# EAGLE design tritiled_v30 (EAGLE 8.2.2)
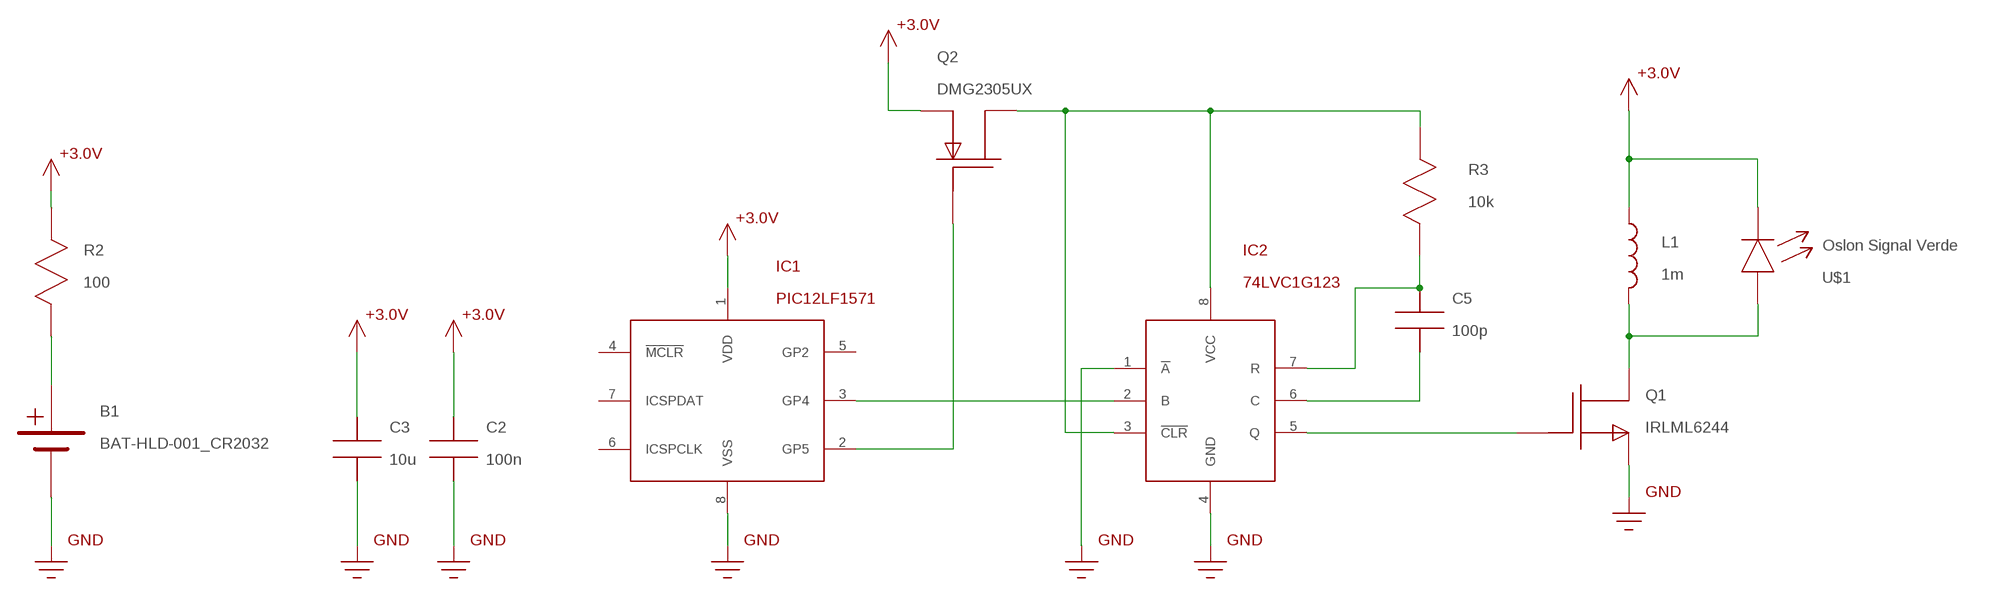
[diagram p0: schematic, sheet 1]

## Parts
B1  BAT-HLD-001_CR2032  [CR2032_BAT-HLD_001]
C2  100n  C0805  [0805]
C3  10u  C1206  [1206]
C5  100p  C0603  [C0603]
IC1  PIC12LF1571  [SOIC8]
IC2  74LVC1G123  [SM8]
L1  1m  SRR6028_INDUCTOR  [SRR6028_INDUCTOR]
Q1  IRLML6244  ZXMN3B01FSOT23  [SOT-23]
Q2  DMG2305UX  DMG2305UXSOT23  [SOT-23]
R2  100  R1206  [R1206]
R3  10k  R0603  [R0603]
U$1  Oslon Signal Verde  OSLON_SIGNAL  [OSLON_3030_LED]

## Nets
+3.6V: C2.P$1 C3.P$1 IC1.1(VDD) L1.P$1 Q2.2(S) R2.P$1 U$1.C ; supply symbol labelled +3.0V
GND: B1.GND(0V) C2.P$2 C3.P$2 IC1.8(VSS) IC2.1(!A!) IC2.4(GND) Q1.2(S)
N$1: C5.P$1 IC2.7(R) R3.P$1
N$2: IC2.5(Q) Q1.1(G)
N$3: IC1.2(GP5) Q2.1(G)
N$4: IC1.3(GP4) IC2.2(B)
N$5: C5.P$2 IC2.6(C)
N$7: IC2.3(!CLR!) IC2.8(VCC) Q2.3(D) R3.P$2
N$9: B1.+V1(+V) B1.+V2(+V) R2.P$2
N$10: L1.P$2 Q1.3(D) U$1.A
Unconnected: IC1.4(!MCLR!) IC1.5(GP2) IC1.6(ICSPCLK) IC1.7(ICSPDAT)

## Library data of the parts
B1 = tritiled:BAT-HLD-001_CR2032
C2 C3 C5 = tritiled:C
IC1 = tritiled:PIC12LF1571
IC2 = tritiled:74LVC1G123
L1 = tritiled:SRR6028_INDUCTOR
Q1 = tritiled:ZXMN3B01F
Q2 = tritiled:DMG2305UX
R2 R3 = tritiled:R
U$1 = tritiled:OSLON_SIGNAL

## Board
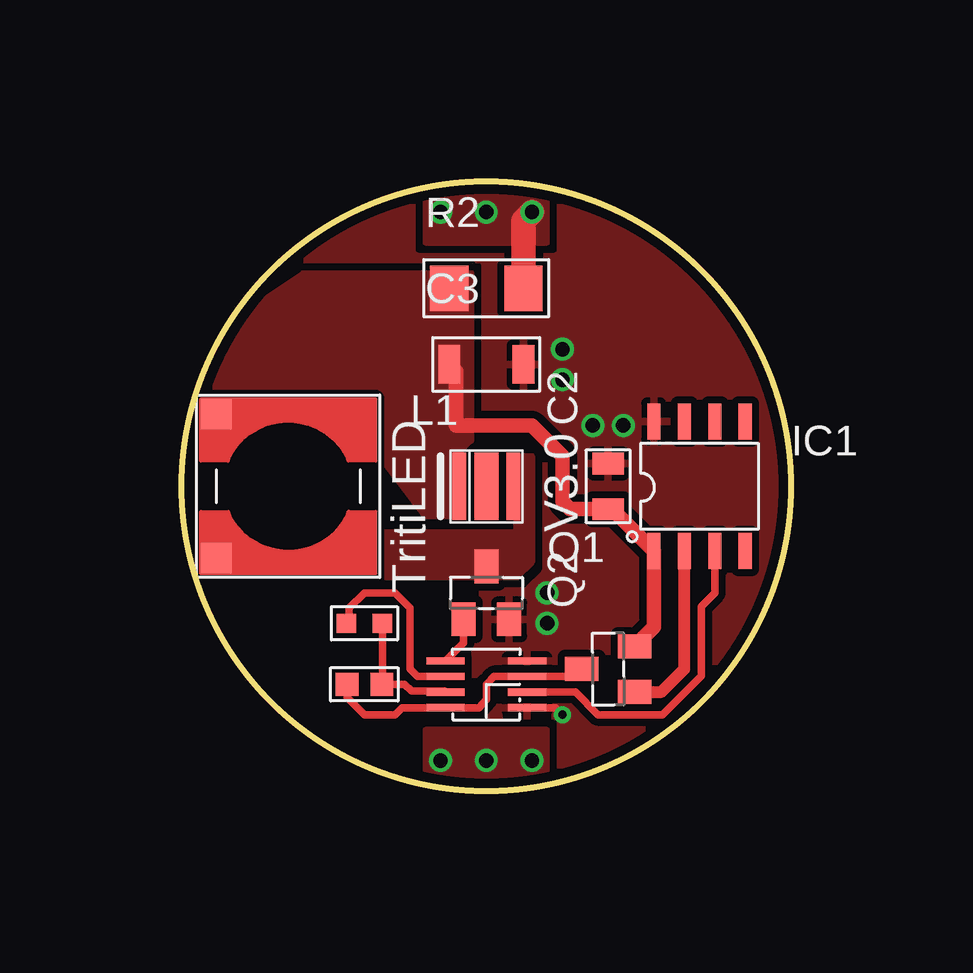
[diagram p1: board, top side]
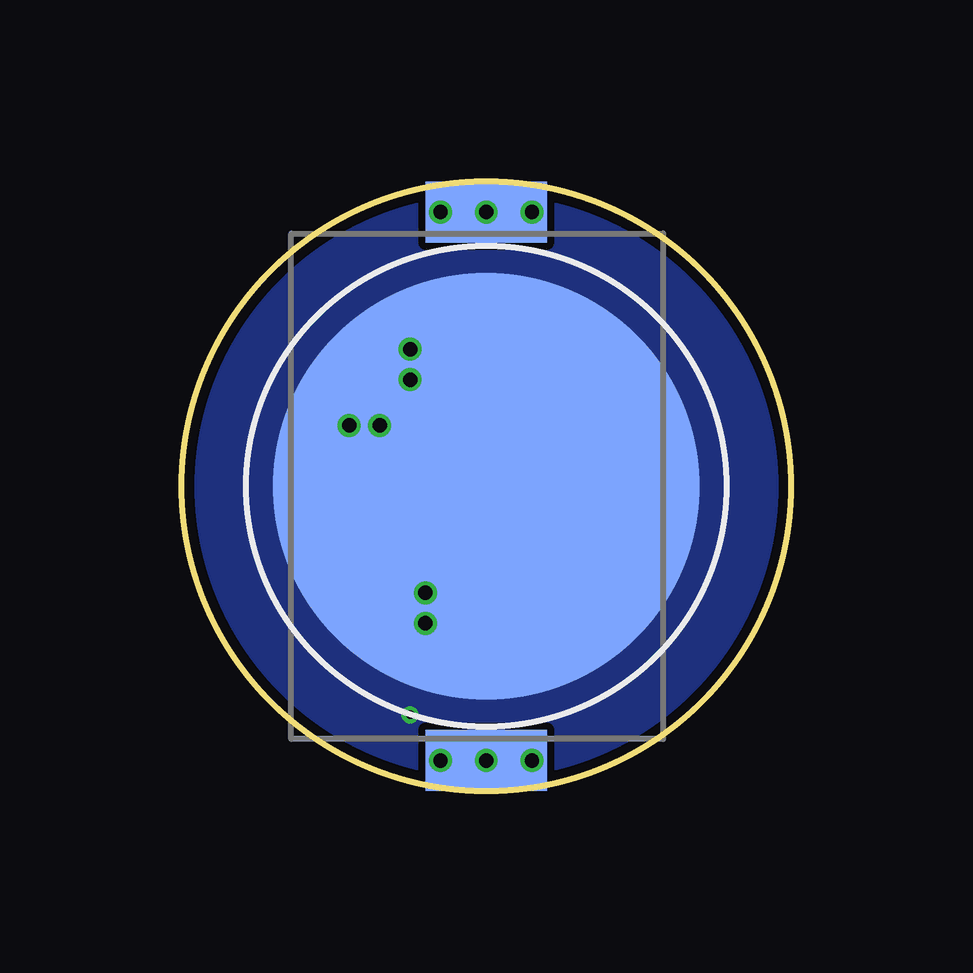
[diagram p2: board, bottom side, seen from below]

Size 25.4 x 25.4 mm. Coordinates in mm from the lower left corner, seen from the top.
Outline: circle at 12.7,12.7 radius 12.7
Copper layers (1*16): Top 0.0356mm / dielectric 1.5011mm / Bottom 0.0356mm
Design rules "LaenPCBOrder_tented_vias_12mil": minimum track width 8mil, minimum drill 13mil, track to track 12mil, track to pad 12mil, pad to pad 12mil, via to via 12mil, smd to smd 12mil, copper to edge 15mil, drill to drill 6mil, minimum pad ring 7mil, minimum via ring 7mil, stop-mask expansion 4mil, vias tented up to drill 28mil, thermal gap 10mil

### Footprints (pad centres in the part's own frame; a part is rotated, then mirrored left to right if it is on the bottom)
CR2032_BAT-HLD_001 = smd 2.54 x 5.08: +V1 -11.43,0; +V2 11.43,0 | smd 17.78 x 17.78: GND 0,0
0805 = smd 0.9 x 1.3: P$1 -0.95,0; P$2 0.95,0
1206 = smd 0.9 x 1.6: P$1 -1.55,0; P$2 1.55,0
C0603 = smd 0.8 x 0.8: P$1 -0.75,0; P$2 0.75,0
SOIC8 = smd 0.55 x 1.5: 1 -1.905,-2.7; 2 -0.635,-2.7; 3 0.635,-2.7; 4 1.905,-2.7; 5 1.905,2.7; 6 0.635,2.7; 7 -0.635,2.7; 8 -1.905,2.7
SM8 = smd 0.3 x 1.6: 1 -0.975,-1.7; 2 -0.325,-1.7; 3 0.325,-1.7; 4 0.975,-1.7; 5 0.975,1.7; 6 0.325,1.7; 7 -0.325,1.7; 8 -0.975,1.7
SRR6028_INDUCTOR = smd 1.27 x 1.27: P$1 -3,3; P$2 -3,-3
SOT-23 = smd 1 x 1.4: 1 -0.95,-1.1; 2 0.95,-1.1; 3 0,1.1
R1206 = smd 1.6 x 1.9: P$1 -1.55,0; P$2 1.55,0
R0603 = smd 0.95 x 0.95: P$1 -0.725,0; P$2 0.725,0
OSLON_3030_LED = smd 0.55 x 2.8: A -1.125,0; C 1.125,0 | smd 1 x 2.8: HS 0,0

### Placement (x,y rotation side)
B1  12.7,12.7 270 bottom
C2  17.78,12.7 90 top
C3  12.7,17.78 0 top
C5  7.62,6.99 180 top
IC1  21.59,12.7 0 top
IC2  12.7,4.45 90 top
L1  4.45,12.7 0 top
Q1  12.7,8.26 0 top
Q2  17.78,5.08 90 top
R2  12.7,20.95 0 top
R3  7.62,4.45 180 top
U$1  12.7,12.7 180 top

### Tracks (layer width: path | path; a pad name or v marks a point on that pad's centre or on a via)
+3.6V
  Top 0.61: C3.P$1 11.43,17.5 11.43,15.24 14.61,15.24 15.88,13.97 15.88,12.06 16.19,11.75 C2.P$1 17.93,11.75 IC1.1 19.68,6.83 Q2.2
  pour Top (no thermals): 12.06,21.59 12.06,14.61 11.43,13.97 11.43,11.43 10.16,11.43 8.26,13.97 6.99,13.97 5.71,15.24 4.45,15.88 1.27,15.88 1.27,17.14 3.17,20.32 5.08,21.59
GND  (via drill 0.35, 0.6)
  Top 0.305: IC2.1 15.58,3.47 v15.88,3.17
  other vias: 17.14,15.24 18.41,15.24 15.24,8.26 15.24,6.99 15.88,18.41 15.88,17.14
  pour Top (rank 2): 0,0 0,25.4 25.4,25.4 25.4,0
  pour Bottom (no thermals): 0,0 0,25.4 25.4,25.4 25.4,0
N$1
  Top 0.305: IC2.7 10.96,4.16 9.58,4.16 9.3,4.45 R3.P$1 8.37,4.47 C5.P$1
N$2
  Top 0.305: IC2.5 11.75,6.17 Q1.1
N$3
  Top 0.508: Q2.1 20,4.13 20.95,5.08 IC1.2
N$4
  Top 0.305: IC2.2 16.41,4.12 17.36,3.17 20.05,3.17 21.67,4.79 21.67,7.7 22.23,8.26 IC1.3
N$5
  Top 0.305: IC2.6 9.84,4.77 9.53,5.08 9.53,7.62 8.89,8.26 7.62,8.26 6.99,7.62 6.99,7.1 C5.P$2
N$7
  Top 0.305: Q2.3 16.37,4.77 IC2.3 13.03,4.77 12.7,4.45 12.7,3.81 12.4,3.47 IC2.8 9.19,3.47 8.89,3.17 7.62,3.17 6.89,3.9 R3.P$2
N$9  (via drill 0.6)
  Top 1.016: v14.61,24.13 14.25,23.77 R2.P$2
  other vias: 12.7,1.27 10.79,1.27 14.61,1.27 12.7,24.13 10.79,24.13
  pour Top (no thermals): 10.16,25.4 10.16,22.86 15.24,22.86 15.24,25.4
  pour Top (no thermals): 10.16,2.54 10.16,0 15.24,0 15.24,2.54
N$10
  pour Top (no thermals): 13.97,13.97 14.61,13.97 14.61,9.53 13.97,8.89 1.27,8.89 1.27,9.53 7.62,9.53 8.26,10.79 13.97,10.79

### Text on the board
tPlace: V3.0 | TritiLED